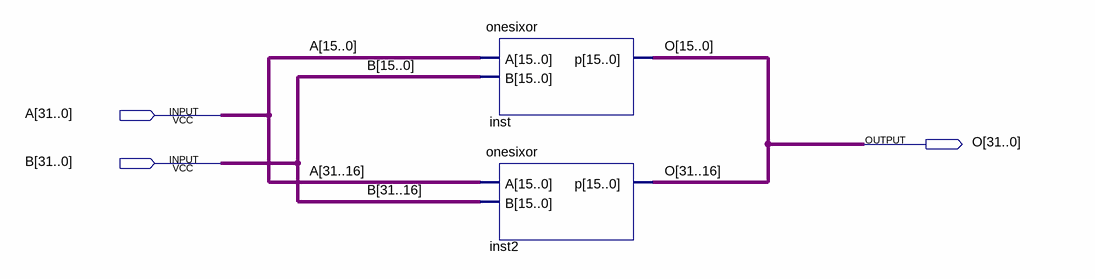
[diagram p0: schematic sheet]
// Quartus schematic threetwoor.bdf as structural Verilog: 2 symbols, 3 pins
module threetwoor (
  input  [31:0] A,
  input  [31:0] B,
  output [31:0] O
);

  onesixor inst (.A(A[15:0]), .B(B[15:0]), .p(O[15:0]));
  onesixor inst2 (.A(A[31:16]), .B(B[31:16]), .p(O[31:16]));
endmodule
